# Altium schematic sheet CurlingStoneSchematic.SchDoc: Curling Stone
size A4; Author: Martin Moldsvor; DocumentNumber: 1; Revision: 1.0; SheetNumber: 1; SheetTotal: 1
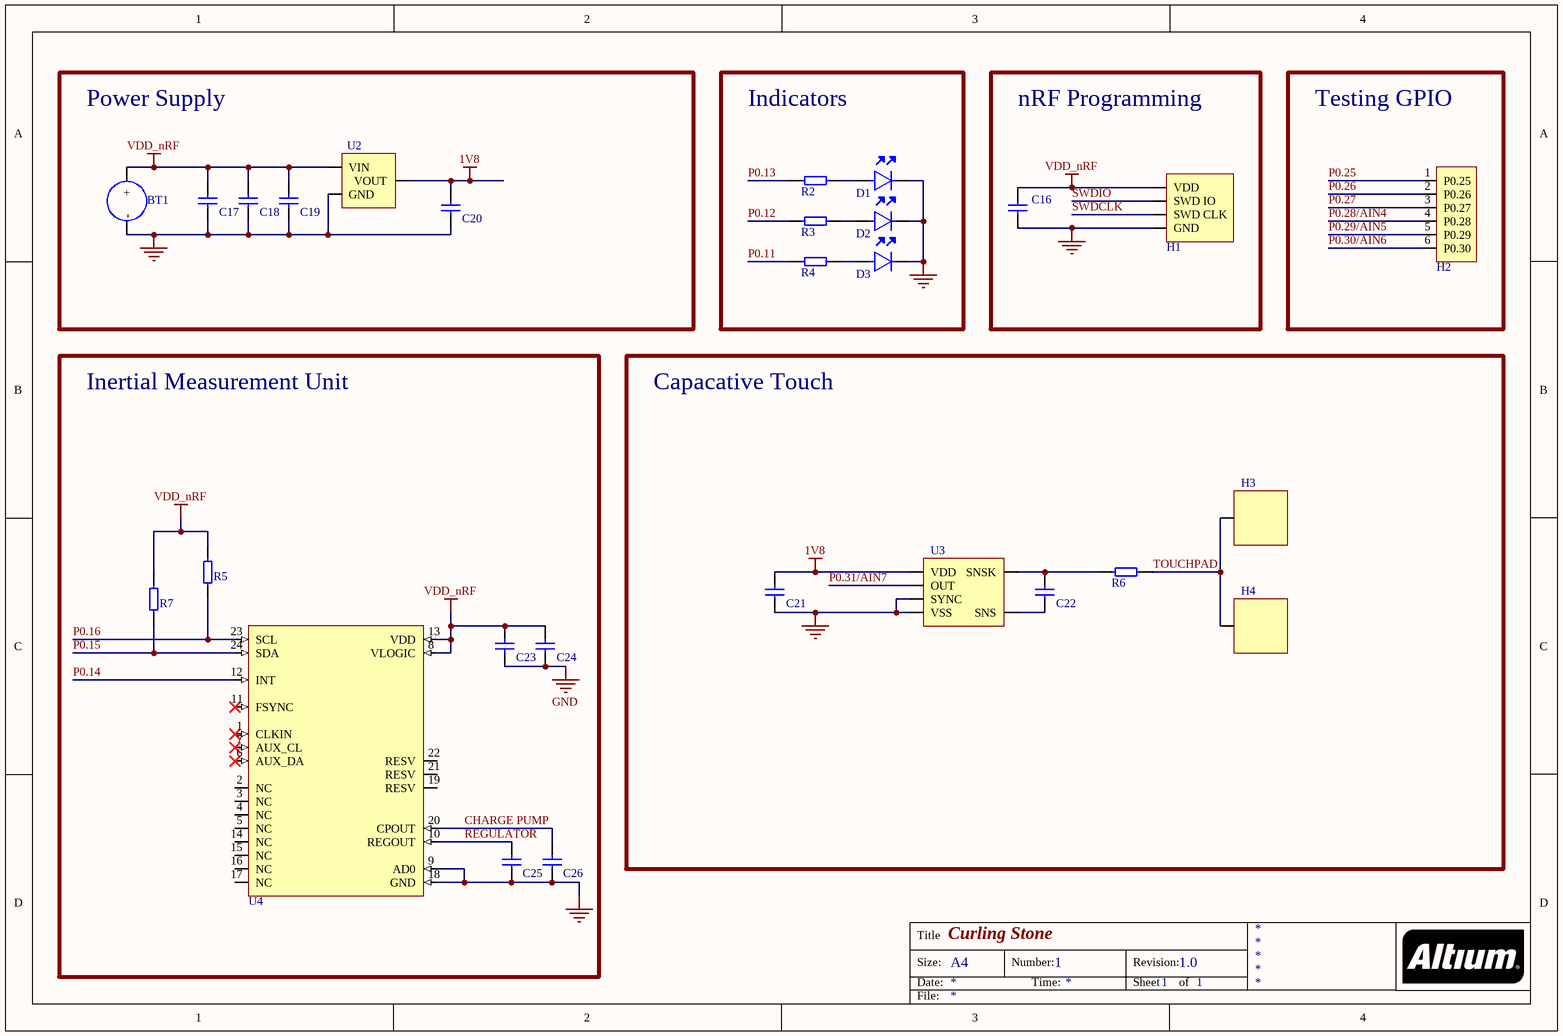
[diagram p0: CurlingStoneSchematic.SchDoc]

## Parts
BT1  Battery Holder  [Battery Holder]  (value not drawn)
C16  0603 Capacitor  [0603]  (value not drawn)
C17  0603 Capacitor  [0603]  (value not drawn)
C18  0603 Capacitor  [0603]  (value not drawn)
C19  0603 Capacitor  [0603]  (value not drawn)
C20  0603 Capacitor  [0603]  (value not drawn)
C21  0603 Capacitor  [0603]  (value not drawn)
C22  0603 Capacitor  [0603]  (value not drawn)
C23  0603 Capacitor  [0603]  (value not drawn)
C24  0603 Capacitor  [0603]  (value not drawn)
C25  0603 Capacitor  [0603]  (value not drawn)
C26  0603 Capacitor  [0603]  (value not drawn)
D1  0603 LED  [0603 LED]  (value not drawn)
D2  0603 LED  [0603 LED]  (value not drawn)
D3  0603 LED  [0603 LED]  (value not drawn)
H1  4x1 Header  [4x1 HEADER TH]  (value not drawn)
H2  6x1 Header  [6x1 HEADER TH]  (value not drawn)
H3  Electrode  [ELECTRODE EXTERNAL]  (value not drawn)
H4  Electrode  [ELECTRODE INTERNAL]  (value not drawn)
R2  0603 Resistor  [0603]  (value not drawn)
R3  0603 Resistor  [0603]  (value not drawn)
R4  0603 Resistor  [0603]  (value not drawn)
R5  0603 Resistor  [0603]  (value not drawn)
R6  0603 Resistor  [0603]  (value not drawn)
R7  0603 Resistor  [0603]  (value not drawn)
U2  MCP1700 1V8  [MCP1700 SOT-23]  (value not drawn)
U3  Capacative Touch  [CAPACATIVE TOUCH]  (value not drawn)
U4  MPU-6050  [MPU-6050]  (value not drawn)

## Blocks framed on the sheet
Power Supply: BT1 C17-C20 U2
Indicators: D1-D3 R2-R4
nRF Programming: C16 H1
Testing GPIO: H2
Inertial Measurement Unit: C23-C26 R5 R7 U4
Capacative Touch: C21 C22 H3 H4 R6 U3

## Nets
1V8: C20.2 C21.2 U2.2(VOUT) U3.5(VDD)
GND: BT1.2(-) C16.1 C17.1 C18.1 C19.1 C20.1 C21.1 C23.1 C24.1 C25.1 C26.1 D1.2 D2.2 D3.2 H1.2(GND) U2.1(GND) U3.2(VSS) U3.6(SYNC) U4.9(AD0) U4.18(GND)
VDD_nRF: BT1.1(+) C16.2 C17.2 C18.2 C19.2 C23.2 C24.2 H1.1(VDD) R5.2 R7.2 U2.3(VIN) U4.8(VLOGIC) U4.13(VDD)
CHARGE PUMP: C26.2 U4.20(CPOUT)
P0.11: R4.1
P0.12: R3.1
P0.13: R2.1
P0.14: U4.12(INT)
P0.15: R7.1 U4.24(SDA)
P0.16: R5.1 U4.23(SCL)
P0.25: H2.1(P0.25)
P0.26: H2.2(P0.26)
P0.27: H2.3(P0.27)
P0.28/AIN4: H2.4(P0.28)
P0.29/AIN5: H2.5(P0.29)
P0.30/AIN6: H2.6(P0.30)
P0.31/AIN7: U3.1(OUT)
REGULATOR: C25.2 U4.10(REGOUT)
SWDCLK: H1.3(SWD_CLK)
SWDIO: H1.4(SWD_IO)
TOUCHPAD: H3.1(GND) H4.1(GND) R6.2
NetC22_1: C22.1 U3.4(SNS)
NetC22_2: C22.2 R6.1 U3.3(SNSK)
NetD1_1: D1.1 R2.2
NetD2_1: D2.1 R3.2
NetD3_1: D3.1 R4.2

Not connected (* = marked no-connect by the designer): U4 1(CLKIN)* 2(NC) 3(NC) 4(NC) 5(NC) 6(AUX_DA)* 7(AUX_CL)* 11(FSYNC)* 14(NC) 15(NC) 16(NC) 17(NC) 19(RESV) 21(RESV) 22(RESV)

## Notes on the sheet
- Title
- Size:
- Date:
- A4
- Number:
- Time:
- Revision:
- Sheet
- of
- File:

## Library data of the parts
BT1 = Battery Holder: Battery Holder 1-Cell 20mm Size Tin Nickel SMT Mount T/R; Manufacturer 1: Keystone Electronics; Manufacturer Part Number 1: 3034TR; Number of Batteries: 1; Supplier 1: Digi-Key; Supplier Part Number 1: 36-3034CT-ND; RoHS: Yes; Category: Uncategorized; Stock 1: 74655; Pricing 1: 1=0.42000, 25=0.37760, 100=0.28630, 250=0.25592 (USD); Mount: Surface Mount,PCB; Case/Package: SMD/SMT; Material: Bronze; Contact Plating: Tin; Termination: SMD/SMT; Packaging: Tape and Reel; Package Quantity: 500; Number of Cells: 1; Lead Free: Lead Free; ComponentLink1URL: https://datasheet.ciiva.com/29204/3034tr-29204080.pdf?src-supplier=Digi-Key; ComponentLink1Description: https://datasheet.ciiva.com/29204/3034tr-29204080.pdf?src-supplier=Digi-Key; ComponentLink2URL: https://datasheet.ciiva.com/41797/3034-41797079.pdf?src-supplier=Digi-Key; ComponentLink2Description: https://datasheet.ciiva.com/41797/3034-41797079.pdf?src-supplier=Digi-Key
D1-D3 = 0603 LED: LED Uni-Color Green 574nm 2-Pin Chip LED T/R; Manufacturer 1: Vishay Lite-On; Manufacturer Part Number 1: LTST-C191KGKT; Lens Color: Colorless; Power Rating: 75mW; Luminous Intensity: 35mcd; Viewing Angle: 130°; Lens Style: Rectangular,Colorless; Forward Current: 30mA; Forward Voltage: 2V; Dominant Wavelength: 571nm; Test Current: 20mA; Lens Transparency: Clear; Number of Elements: 1; Reverse Voltage: 5V; Supplier 1: Digi-Key; Supplier Part Number 1: 160-1446-1-ND; RoHS: Yes; Category: LEDs; Pricing 1: 1=0.26000, 10=0.14100, 100=0.06560, 500=0.06060, 1000=0.04747, 2000=0.04646 (USD); Mount: Surface Mount; Case/Package: 0603; Number of Pins: 2; Color: Green; Case Code (Metric): 1608; Case Code (Imperial): 0603; Min Operating Temperature: -55°C; Max Operating Temperature: 85°C; Packaging: Tape and Reel; Package Quantity: 1; Illumination Color: Green; Power Dissipation: 75mW; Wavelength: 574nm; Number of LEDs: 1; Max Power Dissipation: 75mW; Length: 1.6mm; Width: 0.8mm; Height: 0.55mm; Depth: 0.8mm; Radiation Hardening: No; Lead Free: Lead Free; RoHS Compliant: Yes; ComponentLink1URL: https://datasheet.ciiva.com/2109/ltst-c191kgkt-2109973.pdf?src-supplier=Digi-Key; ComponentLink1Description: https://datasheet.ciiva.com/2109/ltst-c191kgkt-2109973.pdf?src-supplier=Digi-Key
U2 = MCP1700 1V8: V REG, LDO 250MA, SMD, SOT-23-3; Output Voltage:1.8V; Dropout voltage:0.178V; No. of Pins:3; Voltage Regulator IC Case Style:SOT-23; Operating Temperature Range:-40°C to +125°C; Case Style:SOT-23; Max Operating Temperature:125°C; Min;RoHS Compliant: Yes; Manufacturer 1: Microchip; Manufacturer Part Number 1: MCP1700T-1802E/TT; Nominal Output Voltage: 1.8V; Min Input Voltage: 2.3V; Max Input Voltage: 6V; Dropout Voltage: 150mV; Number of Outputs: 1; Max Power Dissipation: 369.6mW; Input Bias Current: 1.6uA; Quiescent Current: 4uA; Polarity: Positive; Accuracy: 2%; Output Type: Fixed; Supplier 1: Digi-Key; Supplier Part Number 1: MCP1700T1802ETTCT-ND; RoHS: Yes; Category: Voltage Regulators - Linear; Stock 1: 24907; Pricing 1: 1=0.39000, 25=0.33000, 100=0.29000 (USD); Mount: Surface Mount; Case/Package: SOT-23; Number of Pins: 3; Min Operating Temperature: -40°C; Max Operating Temperature: 125°C; Packaging: Tape and Reel; Output Current: 250mA; Max Output Current: 250mA; Output Voltage: 1.8V; Max Supply Voltage: 6V; Min Supply Voltage: 2.3V; Package Quantity: 3000; Min Output Voltage: 1.8V; Max Output Voltage: 1.8V; Termination: SMD/SMT; Output Voltage Accuracy: 2%; Nominal Supply Current: 4uA; Power Dissipation: 369.6mW; Supply Current: 4uA; Length: 2.9mm; Width: 1.3mm; Height: 0.95mm; Radiation Hardening: No; REACH SVHC: No SVHC; Lead Free: Lead Free; RoHS Compliant: Yes; ComponentLink1URL: https://datasheet.ciiva.com/14150/mcp1700-eng-tds-14150117.pdf?src-supplier=Distrelec; ComponentLink1Description: https://datasheet.ciiva.com/14150/mcp1700-eng-tds-14150117.pdf?src-supplier=Distrelec; ComponentLink2URL: https://datasheet.ciiva.com/17364/jp011779-17364282.pdf?src-supplier=Avnet+Europe; ComponentLink2Description: https://datasheet.ciiva.com/17364/jp011779-17364282.pdf?src-supplier=Avnet+Europe; ComponentLink3URL: https://datasheet.ciiva.com/2040/21826b-2040109.pdf?src-supplier=Digi-Key; ComponentLink3Description: https://datasheet.ciiva.com/2040/21826b-2040109.pdf?src-supplier=Digi-Key; ComponentLink4URL: https://datasheet.ciiva.com/8041/21826b-8041597.pdf?src-supplier=Element14; ComponentLink4Description: https://datasheet.ciiva.com/8041/21826b-8041597.pdf?src-supplier=Element14; ComponentLink5URL: https://datasheet.ciiva.com/2040/21826b-2040110.pdf?src-supplier=Digi-Key; ComponentLink5Description: https://datasheet.ciiva.com/2040/21826b-2040110.pdf?src-supplier=Digi-Key; ComponentLink6URL: https://datasheet.ciiva.com/8237/jp011779-8237326.pdf?src-supplier=Avnet; ComponentLink6Description: https://datasheet.ciiva.com/8237/jp011779-8237326.pdf?src-supplier=Avnet; ComponentLink7URL: https://datasheet.ciiva.com/16218/filehandler-aspxddocname-en011779-16218350.pdf?src-supplier=Future+Electronics; ComponentLink7Description: https://datasheet.ciiva.com/16218/filehandler-aspxddocname-en011779-16218350.pdf?src-supplier=Future+Electronics
U3 = Capacative Touch: Capacitive Touch Screen 1Keys 6-Pin SOT-23 Tape and Reel; Manufacturer 1: Microchip / Atmel; Manufacturer Part Number 1: AT42QT1011-TSHR; Number of Inputs: 1; Resolution: 14b; Operating Supply Current: 378.5uA; Min Supply Voltage: 1.8V; Max Supply Voltage: 5.5V; Load Capacitance: 50pF; Nominal Supply Current: 729uA; Supplier 1: Digi-Key; Supplier Part Number 1: AT42QT1011-TSHRCT-ND; RoHS: Yes; Category: Uncategorized; Pricing 1: 1=0.61000, 25=0.56000, 100=0.50000 (USD); Mount: Surface Mount; Case/Package: SOT-23-6; Number of Pins: 6; Min Operating Temperature: -40°C; Max Operating Temperature: 85°C; Packaging: Tape and Reel; Package Quantity: 4500; Number of Channels: 1; Touchscreen: Capacitive; Series: QTouch™; Supply Current: 729uA; Length: 3mm; Width: 1.75mm; Height: 1.3mm; RoHS Compliant: Yes; REACH SVHC: No SVHC; Lead Free: Lead Free; ComponentLink1URL: https://datasheet.ciiva.com/1165/731627-1165685.pdf?src-supplier=Element14; ComponentLink1Description: https://datasheet.ciiva.com/1165/731627-1165685.pdf?src-supplier=Element14; ComponentLink2URL: https://datasheet.ciiva.com/14094/at42qt1011-eng-tds-14094872.pdf?src-supplier=Distrelec; ComponentLink2Description: https://datasheet.ciiva.com/14094/at42qt1011-eng-tds-14094872.pdf?src-supplier=Distrelec; ComponentLink3URL: https://datasheet.ciiva.com/1403/doc8287-1403456.pdf?src-supplier=Digi-Key; ComponentLink3Description: https://datasheet.ciiva.com/1403/doc8287-1403456.pdf?src-supplier=Digi-Key; ComponentLink4URL: https://datasheet.ciiva.com/1403/doc8287-1403457.pdf?src-supplier=Digi-Key; ComponentLink4Description: https://datasheet.ciiva.com/1403/doc8287-1403457.pdf?src-supplier=Digi-Key; ComponentLink5URL: https://datasheet.ciiva.com/1403/doc8287-1403458.pdf?src-supplier=Digi-Key; ComponentLink5Description: https://datasheet.ciiva.com/1403/doc8287-1403458.pdf?src-supplier=Digi-Key; ComponentLink6URL: https://datasheet.ciiva.com/15222/getdatasheetpartid-463081-15222284.pdf?src-supplier=Verical; ComponentLink6Description: https://datasheet.ciiva.com/15222/getdatasheetpartid-463081-15222284.pdf?src-supplier=Verical
U4 = MPU-6050: INVENSENSE   MPU-6050   GYRO / ACCEL, 6-AXIS, I2C, QFN-24; Manufacturer 1: TDK InvenSense; Sensor Type: Accelerometer,Gyroscope,3 Axis; Supplier 1: Digi-Key; Supplier Part Number 1: 1428-1007-1-ND; Manufacturer Part Number 1: MPU-6050; RoHS: Yes; Category: Inertial Measurement Units (IMUs); Stock 1: 3318; Pricing 1: 1=7.55000, 5=6.62400, 10=5.96200, 25=5.30000, 50=4.90240, 100=4.24000, 500=3.97500, 1000=3.71000 (USD); Mount: Surface Mount; Case/Package: QFN; Min Operating Temperature: -40°C; Max Operating Temperature: 85°C; Packaging: Tape and Reel; Output Type: I2C; Series: -; RoHS Compliant: Yes; ComponentLink1URL: https://datasheet.ciiva.com/1513/1788002-1513632.pdf?src-supplier=Element14; ComponentLink1Description: https://datasheet.ciiva.com/1513/1788002-1513632.pdf?src-supplier=Element14; ComponentLink2URL: https://datasheet.ciiva.com/22731/1788002-22731434.pdf?src-supplier=Element14; ComponentLink2Description: https://datasheet.ciiva.com/22731/1788002-22731434.pdf?src-supplier=Element14